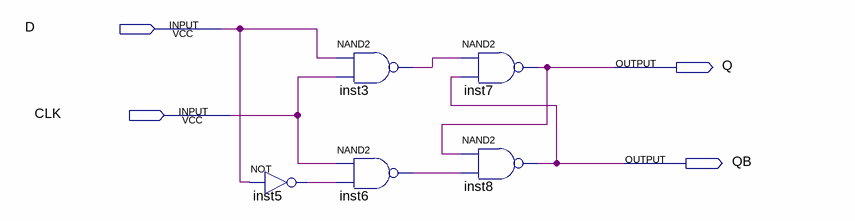
[diagram p0: schematic sheet]
// Quartus schematic figura4exp8.bdf as structural Verilog: 5 symbols, 4 pins
module figura4exp8 (
  input  D,
  input  CLK,
  output Q,
  output QB
);

  wire inst3_out, inst5_out, inst6_out;

  not inst5 (inst5_out, D);
  nand inst3 (inst3_out, D, CLK);
  nand inst6 (inst6_out, CLK, inst5_out);
  nand inst7 (Q, inst3_out, QB);
  nand inst8 (QB, Q, inst6_out);
endmodule
